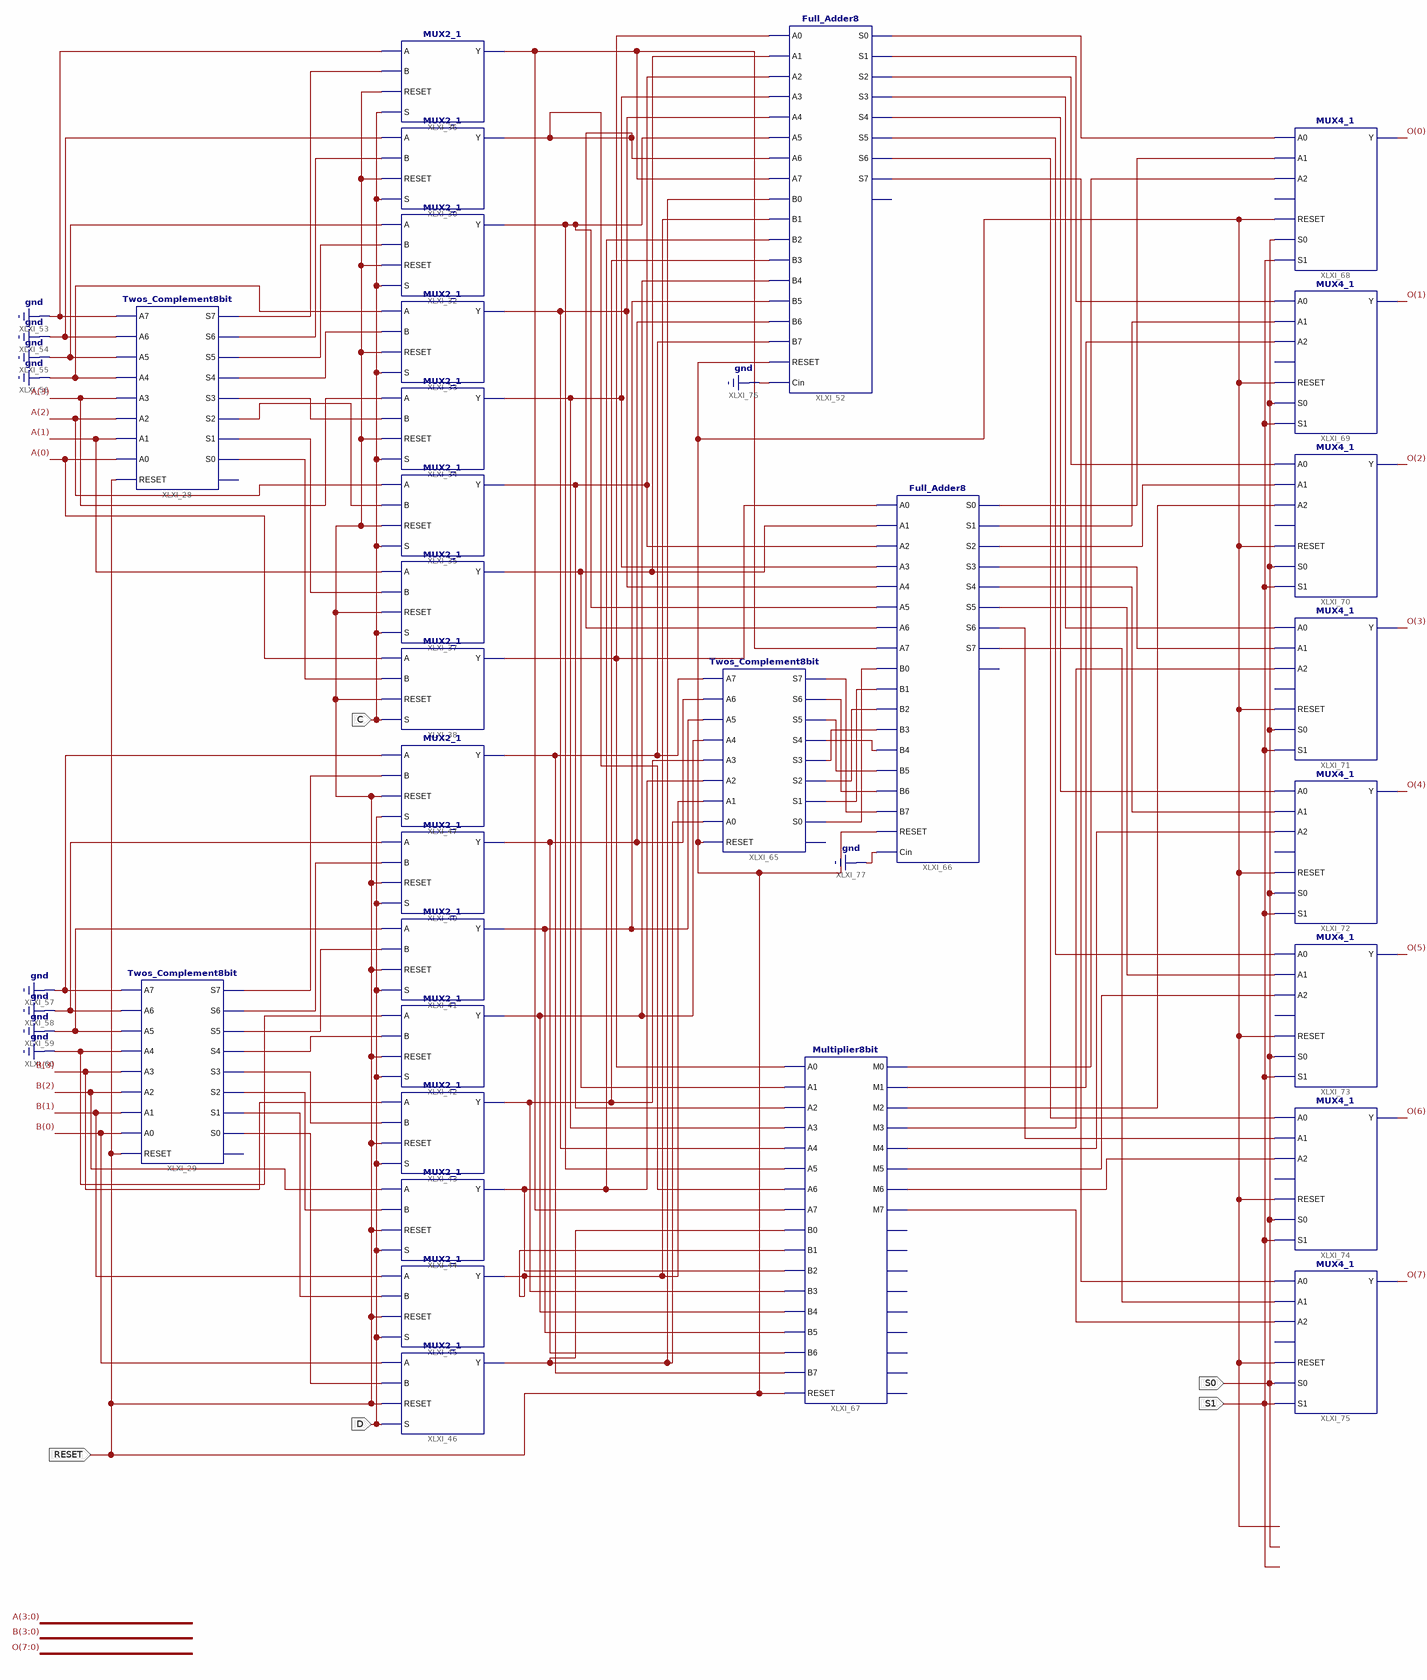
[diagram p0: schematic sheet 1]
// Xilinx ISE schematic Simple_Calculator.sch (artix7) as structural Verilog: 30 symbols, 5 ports
module Simple_Calculator (
  input  C,
  input  D,
  input  S0,
  input  RESET,
  input  S1
);

  wire XLXN_75, XLXN_79, XLXN_81, XLXN_83, XLXN_84, XLXN_85, XLXN_86, XLXN_88, XLXN_99, XLXN_101, XLXN_103,
       XLXN_105, XLXN_106, XLXN_107, XLXN_110, XLXN_112, XLXN_118, XLXN_125, XLXN_126, XLXN_130, XLXN_131,
       XLXN_132, XLXN_133, XLXN_134, XLXN_135, XLXN_136, XLXN_137, XLXN_139, XLXN_140, XLXN_141, XLXN_142,
       XLXN_144, XLXN_146, XLXN_147, XLXN_148, XLXN_150, XLXN_151, XLXN_152, XLXN_153, XLXN_154, XLXN_155,
       XLXN_157, XLXN_158, XLXN_159, XLXN_160, XLXN_161, XLXN_163, XLXN_165, XLXN_166, XLXN_167, XLXN_168,
       XLXN_170, XLXN_171, XLXN_172, XLXN_173, XLXN_174, XLXN_175, XLXN_176, XLXN_177, XLXN_179, XLXN_180,
       XLXN_181, XLXN_218, XLXN_247;
  wire [3:0] A, B;
  wire [7:0] O;

  Twos_Complement8bit XLXI_28 (
    .A0(A[0]), .A1(A[1]), .A2(A[2]), .A3(A[3]), .A4(1'b0), .A5(1'b0), .A6(1'b0), .A7(1'b0), .RESET(RESET),
    .S0(XLXN_88), .S1(XLXN_86), .S2(XLXN_85), .S3(XLXN_84), .S4(XLXN_83), .S5(XLXN_81), .S6(XLXN_79),
    .S7(XLXN_75));  // open: Cout
  MUX2_1 XLXI_30 (.A(1'b0), .B(XLXN_79), .RESET(RESET), .S(C), .Y(XLXN_112));
  MUX2_1 XLXI_32 (.A(1'b0), .B(XLXN_81), .RESET(RESET), .S(C), .Y(XLXN_247));
  MUX2_1 XLXI_33 (.A(1'b0), .B(XLXN_83), .RESET(RESET), .S(C), .Y(XLXN_142));
  MUX2_1 XLXI_34 (.A(A[3]), .B(XLXN_84), .RESET(RESET), .S(C), .Y(XLXN_141));
  MUX2_1 XLXI_35 (.A(A[2]), .B(XLXN_85), .RESET(RESET), .S(C), .Y(XLXN_140));
  MUX2_1 XLXI_36 (.A(1'b0), .B(XLXN_75), .RESET(RESET), .S(C), .Y(XLXN_144));
  MUX2_1 XLXI_37 (.A(A[1]), .B(XLXN_86), .RESET(RESET), .S(C), .Y(XLXN_139));
  MUX2_1 XLXI_38 (.A(A[0]), .B(XLXN_88), .RESET(RESET), .S(C), .Y(XLXN_118));
  MUX2_1 XLXI_40 (.A(1'b0), .B(XLXN_99), .RESET(RESET), .S(D), .Y(XLXN_147));
  MUX2_1 XLXI_41 (.A(1'b0), .B(XLXN_101), .RESET(RESET), .S(D), .Y(XLXN_148));
  MUX2_1 XLXI_42 (.A(1'b0), .B(XLXN_103), .RESET(RESET), .S(D), .Y(XLXN_150));
  MUX2_1 XLXI_43 (.A(B[3]), .B(XLXN_105), .RESET(RESET), .S(D), .Y(XLXN_151));
  MUX2_1 XLXI_44 (.A(B[2]), .B(XLXN_106), .RESET(RESET), .S(D), .Y(XLXN_152));
  MUX2_1 XLXI_45 (.A(B[1]), .B(XLXN_107), .RESET(RESET), .S(D), .Y(XLXN_125));
  MUX2_1 XLXI_46 (.A(B[0]), .B(XLXN_110), .RESET(RESET), .S(D), .Y(XLXN_126));
  MUX2_1 XLXI_47 (.A(1'b0), .B(XLXN_218), .RESET(RESET), .S(D), .Y(XLXN_146));
  Twos_Complement8bit XLXI_29 (
    .A0(B[0]), .A1(B[1]), .A2(B[2]), .A3(B[3]), .A4(1'b0), .A5(1'b0), .A6(1'b0), .A7(1'b0), .RESET(RESET),
    .S0(XLXN_110), .S1(XLXN_107), .S2(XLXN_106), .S3(XLXN_105), .S4(XLXN_103), .S5(XLXN_101), .S6(XLXN_99),
    .S7(XLXN_218));  // open: Cout
  Full_Adder8 XLXI_52 (
    .A0(XLXN_118), .A1(XLXN_139), .A2(XLXN_140), .A3(XLXN_141), .A4(XLXN_142), .A5(XLXN_247), .A6(XLXN_112),
    .A7(XLXN_144), .B0(XLXN_126), .B1(XLXN_125), .B2(XLXN_152), .B3(XLXN_151), .B4(XLXN_150), .B5(XLXN_148),
    .B6(XLXN_147), .B7(XLXN_146), .Cin(1'b0), .RESET(RESET), .S0(XLXN_153), .S1(XLXN_154), .S2(XLXN_155),
    .S3(XLXN_157), .S4(XLXN_158), .S5(XLXN_159), .S6(XLXN_160), .S7(XLXN_161));  // open: Cout
  Twos_Complement8bit XLXI_65 (
    .A0(XLXN_126), .A1(XLXN_125), .A2(XLXN_152), .A3(XLXN_151), .A4(XLXN_150), .A5(XLXN_148), .A6(XLXN_147),
    .A7(XLXN_146), .RESET(RESET), .S0(XLXN_137), .S1(XLXN_136), .S2(XLXN_135), .S3(XLXN_134), .S4(XLXN_133),
    .S5(XLXN_132), .S6(XLXN_131), .S7(XLXN_130));  // open: Cout
  Full_Adder8 XLXI_66 (
    .A0(XLXN_118), .A1(XLXN_139), .A2(XLXN_140), .A3(XLXN_141), .A4(XLXN_142), .A5(XLXN_247), .A6(XLXN_112),
    .A7(XLXN_144), .B0(XLXN_137), .B1(XLXN_136), .B2(XLXN_135), .B3(XLXN_134), .B4(XLXN_133), .B5(XLXN_132),
    .B6(XLXN_131), .B7(XLXN_130), .Cin(1'b0), .RESET(RESET), .S0(XLXN_163), .S1(XLXN_165), .S2(XLXN_166),
    .S3(XLXN_167), .S4(XLXN_168), .S5(XLXN_170), .S6(XLXN_171), .S7(XLXN_172));  // open: Cout
  Multiplier8bit XLXI_67 (
    .A0(XLXN_118), .A1(XLXN_139), .A2(XLXN_140), .A3(XLXN_141), .A4(XLXN_142), .A5(XLXN_247), .A6(XLXN_112),
    .A7(XLXN_144), .B0(XLXN_126), .B1(XLXN_125), .B2(XLXN_152), .B3(XLXN_151), .B4(XLXN_150), .B5(XLXN_148),
    .B6(XLXN_147), .B7(XLXN_146), .M0(XLXN_173), .M1(XLXN_174), .M2(XLXN_175), .M3(XLXN_176), .M4(XLXN_177),
    .M5(XLXN_179), .M6(XLXN_180), .M7(XLXN_181), .RESET(RESET));  // open: Cout, M10, M11, M12, M13, M14, M15, M8, M9
  MUX4_1 XLXI_68 (.A0(XLXN_153), .A1(XLXN_163), .A2(XLXN_173), .RESET(RESET), .S0(S0), .S1(S1), .Y(O[0]));  // open: A3
  MUX4_1 XLXI_69 (.A0(XLXN_154), .A1(XLXN_165), .A2(XLXN_174), .RESET(RESET), .S0(S0), .S1(S1), .Y(O[1]));  // open: A3
  MUX4_1 XLXI_70 (.A0(XLXN_155), .A1(XLXN_166), .A2(XLXN_175), .RESET(RESET), .S0(S0), .S1(S1), .Y(O[2]));  // open: A3
  MUX4_1 XLXI_71 (.A0(XLXN_157), .A1(XLXN_167), .A2(XLXN_176), .RESET(RESET), .S0(S0), .S1(S1), .Y(O[3]));  // open: A3
  MUX4_1 XLXI_72 (.A0(XLXN_158), .A1(XLXN_168), .A2(XLXN_177), .RESET(RESET), .S0(S0), .S1(S1), .Y(O[4]));  // open: A3
  MUX4_1 XLXI_73 (.A0(XLXN_159), .A1(XLXN_170), .A2(XLXN_179), .RESET(RESET), .S0(S0), .S1(S1), .Y(O[5]));  // open: A3
  MUX4_1 XLXI_74 (.A0(XLXN_160), .A1(XLXN_171), .A2(XLXN_180), .RESET(RESET), .S0(S0), .S1(S1), .Y(O[6]));  // open: A3
  MUX4_1 XLXI_75 (.A0(XLXN_161), .A1(XLXN_172), .A2(XLXN_181), .RESET(RESET), .S0(S0), .S1(S1), .Y(O[7]));  // open: A3
endmodule
